# Altium schematic sheet ExtruderBreakoutB.SchDoc
size A
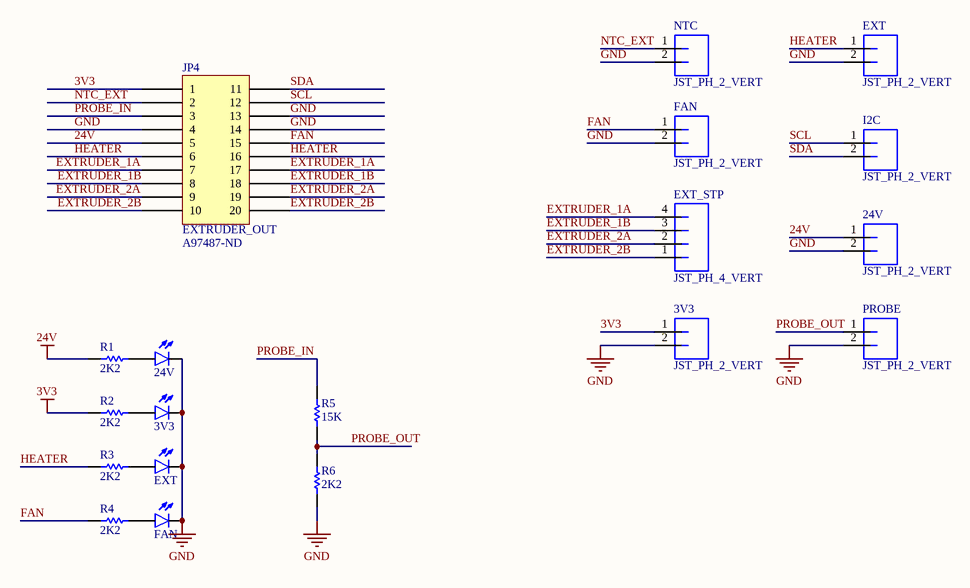
[diagram p0: ExtruderBreakoutB.SchDoc]

## Parts
(Parts that share a designator on the sheet are numbered #1, #2 ... from top to bottom, then left to right.)
3V3#1  JST_PH_2_VERT  [JST-PH-2-PTH-VERT]
3V3#2  LED_0603_BLUE_5mA  [LED0603]  (value not drawn)
24V#1  JST_PH_2_VERT  [JST-PH-2-PTH-VERT]
24V#2  LED_0603_GREEN_5mA  [LED0603]  (value not drawn)
EXT#1  JST_PH_2_VERT  [JST-PH-2-PTH-VERT]
EXT#2  LED_0603_ORANGE_5mA  [LED0603]  (value not drawn)
EXT_STP  JST_PH_4_VERT  [JST-PH-4-PTH-VERT]
FAN#1  JST_PH_2_VERT  [JST-PH-2-PTH-VERT]
FAN#2  LED_0603_ORANGE_5mA  [LED0603]  (value not drawn)
I2C  JST_PH_2_VERT  [JST-PH-2-PTH-VERT]
JP4  EXTRUDER_OUT  Supplier Part Number 1: A97487-ND  [IDC20]
NTC  JST_PH_2_VERT  [JST-PH-2-PTH-VERT]
PROBE  JST_PH_2_VERT  [JST-PH-2-PTH-VERT]
R1  value 2K2  [R0402[1005]]  (hidden comment: 2K2 1% 0402)
R2  value 2K2  [R0402[1005]]  (hidden comment: 2K2 1% 0402)
R3  value 2K2  [R0402[1005]]  (hidden comment: 2K2 1% 0402)
R4  value 2K2  [R0402[1005]]  (hidden comment: 2K2 1% 0402)
R5  value 15K  [R0402[1005]]  (hidden comment: 15K 1% 0402)
R6  value 2K2  [R0402[1005]]  (hidden comment: 2K2 1% 0402)

## Nets
3V3: 3V3#1.1 JP4.1 R2.1
24V: 24V#1.1 JP4.5 R1.1
GND: 3V3#1.2 3V3#2.C 24V#1.2 24V#2.C EXT#1.2 EXT#2.C FAN#1.2 FAN#2.C JP4.4 JP4.13 JP4.14 NTC.2 PROBE.2 R6.1
EXTRUDER_1A: EXT_STP.4 JP4.7 JP4.17
EXTRUDER_1B: EXT_STP.3 JP4.8 JP4.18
EXTRUDER_2A: EXT_STP.2 JP4.9 JP4.19
EXTRUDER_2B: EXT_STP.1 JP4.10 JP4.20
FAN: FAN#1.1 JP4.15 R4.1
HEATER: EXT#1.1 JP4.6 JP4.16 R3.1
NTC_EXT: JP4.2 NTC.1
PROBE_IN: JP4.3 R5.2
PROBE_OUT: PROBE.1 R5.1 R6.2
SCL: I2C.1 JP4.12
SDA: I2C.2 JP4.11
Net3V3#2_A: 3V3#2.A R2.2
Net24V#2_A: 24V#2.A R1.2
NetEXT#2_A: EXT#2.A R3.2
NetFAN#2_A: FAN#2.A R4.2

## Library data of the parts
3V3#1 24V#1 EXT#1 FAN#1 I2C NTC PROBE = JST_PH_2_VERT: Manufacturer: JST Sales America, Inc.; PartNumber: B2B-PH-K-S(LF)(SN); Mounting Technology: Through Hole; PackageReference: JST-PH
3V3#2 = LED_0603_BLUE_5mA: PartNumber: LTST-C193TBKT-5A; Manufacturer: Lite-On Inc.; PackageReference: 0603; PackageDescription: 0603 (1608 Metric); Mounting Technology: Surface Mount
24V#2 = LED_0603_GREEN_5mA: PartNumber: LTST-C193TGKT-5A; Manufacturer: Lite-On Inc.; PackageReference: 0603; PackageDescription: 0603 (1608 Metric); Mounting Technology: Surface Mount
EXT#2 FAN#2 = LED_0603_ORANGE_5mA: PartNumber: LTST-C193KFKT-5A; Manufacturer: Lite-On Inc.; PackageReference: 0603; PackageDescription: 0603 (1608 Metric); Mounting Technology: Surface Mount
EXT_STP = JST_PH_4_VERT: PartNumber: B4B-PH-K-S(LF)(SN); Manufacturer: JST Sales America Inc.; PackageReference: JST-PH; Mounting Technology: Through Hole
JP4 = IDC20: Supplier 1: Digi-Key
R1-R4 R6 = RES_2K2_0402_1%: 2K2 0.063W 1% 0402 (1005 Metric); Manufacturer: KOA Speer; PartNumber: RK73H1ETTP2201F; Tolerance: 1%; Power: 0.063W; Mounting Technology: Surface Mount; PackageReference: 0402; PackageDescription: 0402 (1005 Metric); ComponentLink1Description: Datasheet; ComponentLink1URL: http://www.koaspeer.com/catimages/Products/RK73H/RK73H.pdf
R5 = RES_15K_0402_1%: 15K 0.063W 1% 0402 (1005 Metric); Manufacturer: KOA Speer; PartNumber: RK73H1ETTP1502F; Tolerance: 1%; Power: 0.063W; Mounting Technology: Surface Mount; PackageReference: 0402; PackageDescription: 0402 (1005 Metric); ComponentLink1Description: Datasheet; ComponentLink1URL: http://www.koaspeer.com/catimages/Products/RK73H/RK73H.pdf